# Altium schematic sheet MAX21000.SchDoc
size A
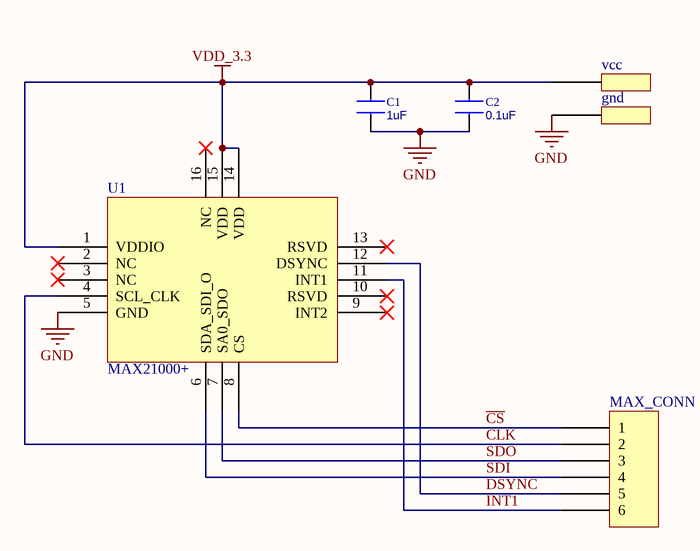
[diagram p0: MAX21000.SchDoc]

## Parts
C1  1uF  [C_0805]
C2  0.1uF  [C_0805]
gnd  1_pin_plate_conn  [1_pin_plate_conn]  (value not drawn)
MAX_CONN  6_pin_plate_conn  [6_pin_plate_conn]  (value not drawn)
U1  MAX21000+  [PQFN50P300X300X100-16N]
vcc  1_pin_plate_conn  [1_pin_plate_conn]  (value not drawn)

## Nets
GND: C1.1 C2.1 gnd.1 U1.5(GND)
VDD_3.3: C1.2 C2.2 U1.1(VDDIO) U1.14(VDD) U1.15(VDD) vcc.1
~{CS}: MAX_CONN.1 U1.8(CS)
CLK: MAX_CONN.2 U1.4(SCL_CLK)
DSYNC: MAX_CONN.5 U1.12(DSYNC)
INT1: MAX_CONN.6 U1.11(INT1)
SDI: MAX_CONN.4 U1.6(SDA_SDI_O)
SDO: MAX_CONN.3 U1.7(SA0_SDO)

Not connected (* = marked no-connect by the designer): U1 2(NC)* 3(NC)* 9(INT2)* 10(RSVD)* 13(RSVD)* 16(NC)*

## Library data of the parts
C1 C2 = CAP_SMD_0805: Capacitor
  C1: Value: 1uF
  C2: Value: 0.1uF
U1 = max21000: 3-axis digital gyroscope